# Altium schematic sheet DSO_Clock.SchDoc: Schematic_Name
size A4; CompanyName: University of Melbourne; Engineer: Your Name Here; DocumentNumber: 1; Revision: 0.1; SheetNumber: 1; SheetTotal: 1; Title_Project: Project_Title; StudentNo: Student No.
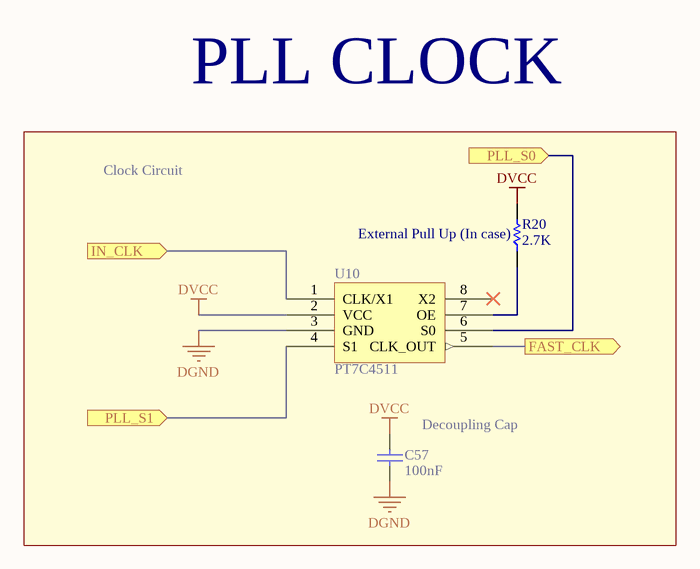
[diagram p0: DSO_Clock.SchDoc]

## Parts
C57  100nF  [0805C]
R20  2.7K  [0805]
U10  PT7C4511  [SOIC-8]

## Ports
FAST_CLK (out), IN_CLK (in), PLL_S0 (in), PLL_S1 (in)

## Nets
DGND: C57.2 U10.3(GND)
DVCC: C57.1 R20.2 U10.2(VCC)
FAST_CLK: U10.5(CLK_OUT) ; port FAST_CLK
IN_CLK: U10.1(CLK/X1) ; port IN_CLK
PLL_S0: U10.6(S0) ; port PLL_S0
PLL_S1: U10.4(S1) ; port PLL_S1
NetR20_1: R20.1 U10.7(OE)

Not connected (* = marked no-connect by the designer): U10 8(X2)*

## Notes on the sheet
- PLL CLOCK
- Clock Circuit
- (near R20) External Pull Up (In case)
- (near C57) Decoupling Cap

## Library data of the parts
C57 = C: Capacitor; Reviewed by: RM - 2018/08/05; Revision: July-2002: Re-released for DXP Platform.; Supplier 1: *; Supplier Part Number 1: *; Value: 100nF
R20 = R: Resistor; Reviewed by: RM - 2018/08/05; Supplier 1: *; Suppler Part Number 1: *; Value: 2.7K
U10 = PT7C4511: PLL Clock Multiplier; Reviewed by: RM - 2018/08/05; Supplier 1: Digi-Key; Supplier Part Number 1: PT7C4511WEXDICT-ND